# Altium schematic sheet SALIDA RF.SchDoc
size A4; SheetNumber: 6; SheetTotal: 6
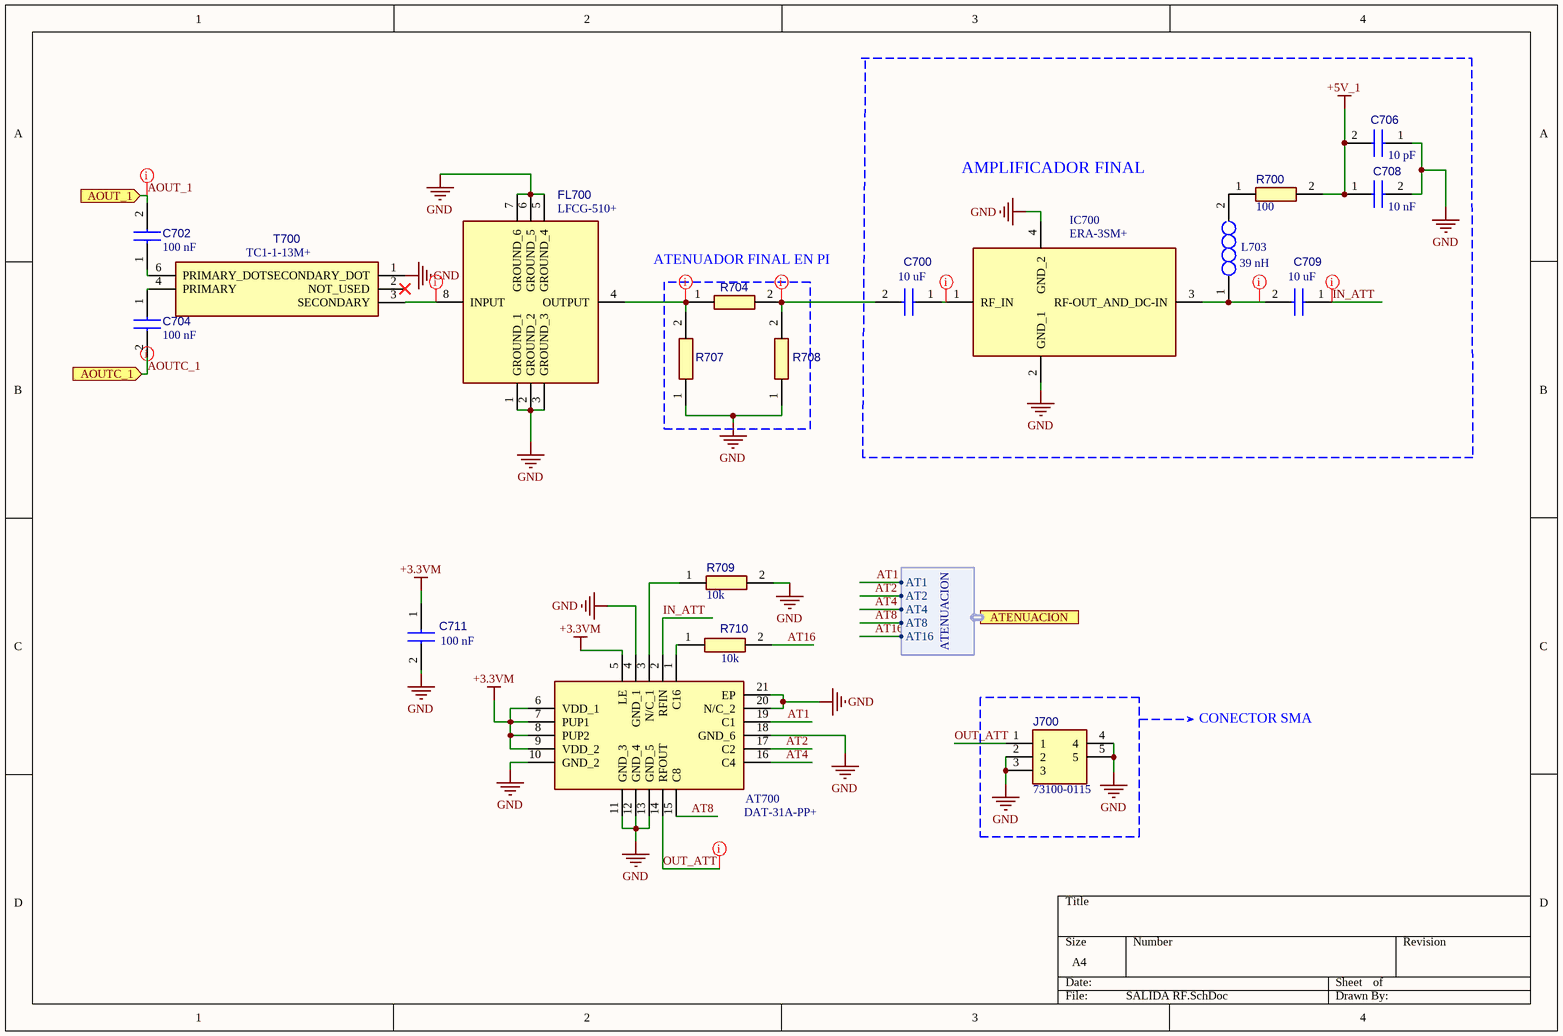
[diagram p0: SALIDA RF.SchDoc]

## Parts
AT700  DAT-31A-PP+  [QFN50P400X400X85-21N]
C700  10 uF  [C0603]
C702  100 nF  [C0603]
C704  100 nF  [C0603]
C706  10 pF  [C0603]
C708  10 nF  [C0603]
C709  10 uF  [C0603]
C711  100 nF  [C0603]
FL700  LFCG-510+  [LFCG2000]
IC700  ERA-3SM+  [ERA3SM]
J700  73100-0115  [731000115]
L703  39 nH  [INDC1608X95N]
R700  100  [RESC1608X55N]
R704  0  [RESC1608X55N]  (value not drawn)
R707  ATENUADOR  [RESC1608X55N]  (value not drawn)
R708  ATENUADOR  [RESC1608X55N]  (value not drawn)
R709  10k  [RESC1608X55N]
R710  10k  [RESC1608X55N]
T700  TC1-1-13M+  [TC414]

## Ports
AOUT_1 (in), AOUTC_1 (in), ATENUACION (harness ATENUACION)

## Harnesses
ATENUACION: AT1, AT2, AT4, AT8, AT16

## Nets
+3.3VM: AT700.5(LE) AT700.6(VDD_1) AT700.7(PUP1) AT700.8(PUP2) AT700.9(VDD_2) C711.1
+5V_1: C706.2 C708.1 R700.2
GND: AT700.4(GND_1) AT700.10(GND_2) AT700.11(GND_3) AT700.12(GND_4) AT700.13(GND_5) AT700.18(GND_6) AT700.20(N/C_2) AT700.21(EP) C706.1 C708.2 C711.2 FL700.1(GROUND_1) FL700.2(GROUND_2) FL700.3(GROUND_3) FL700.5(GROUND_4) FL700.6(GROUND_5) FL700.7(GROUND_6) IC700.2(GND_1) IC700.4(GND_2) J700.2 J700.3 J700.4 J700.5 R707.1 R708.1 R709.2 T700.1(SECONDARY_DOT)
AOUT_1: C702.2 ; port AOUT_1
AOUTC_1: C704.2 ; port AOUTC_1
AT1: AT700.19(C1) ; port ATENUACION.AT1
AT2: AT700.17(C2) ; port ATENUACION.AT2
AT4: AT700.16(C4) ; port ATENUACION.AT4
AT8: AT700.15(C8) ; port ATENUACION.AT8
AT16: R710.2 ; port ATENUACION.AT16
IN_ATT: AT700.2(RFIN) C709.1
OUT_ATT: AT700.14(RFOUT) J700.1
NetAT700_1: AT700.1(C16) R710.1
NetAT700_3: AT700.3(N/C_1) R709.1
NetC700_1: C700.1 IC700.1(RF_IN)
NetC700_2: C700.2 R704.2 R708.2
NetC702_1: C702.1 T700.6(PRIMARY_DOT)
NetC704_1: C704.1 T700.4(PRIMARY)
NetC709_2: C709.2 IC700.3(RF-OUT_AND_DC-IN) L703.1
NetFL700_4: FL700.4(OUTPUT) R704.1 R707.2
NetFL700_8: FL700.8(INPUT) T700.3(SECONDARY)
NetL703_2: L703.2 R700.1

Not connected (* = marked no-connect by the designer): T700 2(NOT_USED)*

## Layout directives
net class RF: AOUT_1, AOUTC_1, IN_ATT, NetC700_1, NetC700_2, NetC709_2, NetFL700_4, NetFL700_8, OUT_ATT

## Notes on the sheet
- AMPLIFICADOR FINAL
- (near R704) ATENUADOR FINAL EN PI
- CONECTOR SMA

## Library data of the parts
AT700 = DAT-31A-PP+: Attenuator or Isolator; Manufacturer_Name: Mini-Circuits; Datasheet Link: https://www.minicircuits.com/pdfs/DAT-31A-PP+.pdf; Height: 0.85mm; Manufacturer_Part_Number: DAT-31A-PP+; Mouser Part Number: 139-DAT-31A-PP+; Mouser Price/Stock: https://www.mouser.co.uk/ProductDetail/Mini-Circuits/DAT-31A-PP%2b?qs=iLbezkQI%252BsipsaaDf6EyAg%3D%3D
C700 C702 C704 C706 C708 C709 C711 = C0603H470J5GACTU: Capacitor; Manufacturer_Name: KEMET; Datasheet Link: https://content.kemet.com/datasheets/KEM_C1001_C0G_200C_SMD.pdf; Height: 0.87mm; Manufacturer_Part_Number: C0603H470J5GACTU
FL700 = LFCG-2000+: Filter; Manufacturer_Name: Mini-Circuits; Datasheet Link: https://www.minicircuits.com/WebStore/dashboardPdf?model=LFCG-2000%2B; Height: 0.95mm; Manufacturer_Part_Number: LFCG-2000+; Mouser Part Number: 139-LFCG-2000+; Mouser Price/Stock: https://www.mouser.co.uk/ProductDetail/Mini-Circuits/LFCG-2000%2b?qs=DRkmTr78QATAEe9U%2FxoX1Q%3D%3D
IC700 = ERA-3SM+: Integrated Circuit; Manufacturer_Name: Mini-Circuits; Datasheet Link: https://www.minicircuits.com/WebStore/dashboard.html?model=ERA-3SM%2B; Height: 1.52mm; Manufacturer_Part_Number: ERA-3SM+; Mouser Part Number: 139-ERA-3SM; Mouser Price/Stock: https://www.mouser.co.uk/ProductDetail/Mini-Circuits/ERA-3SM%2b?qs=xZ%2FP%252Ba9zWqY4QiJxdjLZgw%3D%3D
J700 = 73100-0115: Connector; Manufacturer_Name: Molex; Datasheet Link: https://www.molex.com/pdm_docs/sd/731000115_sd.pdf; Height: 9.57mm; Manufacturer_Part_Number: 73100-0115; Mouser Part Number: 538-73100-0115; Mouser Price/Stock: https://www.mouser.co.uk/ProductDetail/Molex/73100-0115?qs=dxVETAvtHz69wpck%252B7ItSw%3D%3D
L703 = AIML-0603-100K-T: Inductor; Manufacturer_Name: ABRACON; Datasheet Link: https://abracon.com/Magnetics/new/AIML-0603.pdf; Height: 0.95mm; Manufacturer_Part_Number: AIML-0603-100K-T; Mouser Part Number: 815-AIML-0603-100KT; Mouser Price/Stock: https://www.mouser.co.uk/ProductDetail/ABRACON/AIML-0603-100K-T?qs=1vO2EIVe%252BY5tBY%252BpVVThrw%3D%3D; Arrow Part Number: AIML-0603-100K-T; Arrow Price/Stock: https://www.arrow.com/en/products/aiml-0603-100k-t/abracon?region=nac
R700 R704 R707-R710 = CR0603-FX-1431ELF: Resistor; Manufacturer_Name: Bourns; Datasheet Link: https://www.bourns.com/pdfs/chpreztr.pdf; Height: 0.55mm; Manufacturer_Part_Number: CR0603-FX-1431ELF; Mouser Part Number: 652-CR0603FX-1431ELF; Mouser Price/Stock: https://www.mouser.co.uk/ProductDetail/Bourns/CR0603-FX-1431ELF?qs=e7cxVwPieurCzASkAzK2%252Bg%3D%3D
T700 = TC1-1-13M+: Transformer; Manufacturer_Name: Mini-Circuits; Datasheet Link: https://datasheet.datasheetarchive.com/originals/distributors/Datasheets-28/DSA-546322.pdf; Height: 4.06mm; Manufacturer_Part_Number: TC1-1-13M+; Mouser Part Number: 139-TC1-1-13M; Mouser Price/Stock: https://www.mouser.co.uk/ProductDetail/Mini-Circuits/TC1-1-13M%2b?qs=xZ%2FP%252Ba9zWqYek%252BZGAF2fWg%3D%3D